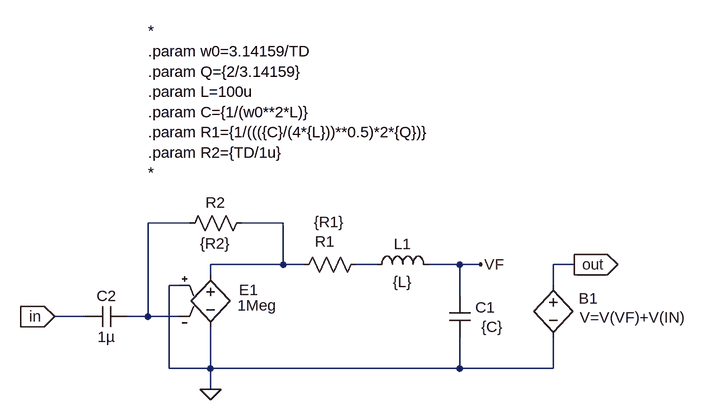
[diagram p0: schematic Zminus1ANA.asc]
Zminus1ANA.asc, the LTspice schematic file:
Version 4
SHEET 1 880 680
WIRE 64 64 0 64
WIRE 208 64 144 64
WIRE 208 128 208 64
WIRE 208 128 96 128
WIRE 240 128 208 128
WIRE 352 128 320 128
WIRE 480 128 432 128
WIRE 512 128 480 128
WIRE 656 128 624 128
WIRE 96 144 96 128
WIRE 48 160 32 160
WIRE 624 160 624 128
WIRE 480 176 480 128
WIRE -96 208 -144 208
WIRE 0 208 0 64
WIRE 0 208 -32 208
WIRE 48 208 0 208
WIRE 32 288 32 160
WIRE 96 288 96 224
WIRE 96 288 32 288
WIRE 480 288 480 240
WIRE 480 288 96 288
WIRE 624 288 624 240
WIRE 624 288 480 288
WIRE 96 320 96 288
FLAG 96 320 0
FLAG 512 128 VF
FLAG 656 128 out
IOPIN 656 128 Out
FLAG -144 208 in
IOPIN -144 208 In
DATAFLAG 640 128 ""
SYMBOL e 96 128 R0
WINDOW 0 44 39 Left 2
WINDOW 3 42 63 Left 2
SYMATTR InstName E1
SYMATTR Value 1Meg
SYMBOL res 336 112 R90
WINDOW 0 -4 64 VBottom 2
WINDOW 3 -65 57 VTop 2
SYMATTR InstName R1
SYMATTR Value {R1}
SYMBOL cap 496 240 R180
WINDOW 0 -39 46 Left 2
WINDOW 3 -51 16 Left 2
SYMATTR InstName C1
SYMATTR Value {C}
SYMBOL res 160 48 R90
WINDOW 0 0 56 VBottom 2
WINDOW 3 32 56 VTop 2
SYMATTR InstName R2
SYMATTR Value {R2}
SYMBOL ind 336 144 R270
WINDOW 0 32 56 VTop 2
WINDOW 3 5 56 VBottom 2
SYMATTR InstName L1
SYMATTR Value {L}
SYMBOL cap -32 192 R90
WINDOW 0 0 32 VBottom 2
WINDOW 3 32 32 VTop 2
SYMATTR InstName C2
SYMATTR Value 1µ
SYMBOL bv 624 144 R0
WINDOW 0 39 36 Left 2
WINDOW 3 41 65 Left 2
SYMATTR InstName B1
SYMATTR Value V=V(VF)+V(IN)
TEXT 0 -232 Left 2 !*\n.param w0=3.14159/TD\n.param Q={2/3.14159}\n.param L=100u\n.param C={1/(w0**2*L)}\n.param R1={1/((({C}/(4*{L}))**0.5)*2*{Q})}\n.param R2={TD/1u}\n*

The netlist it stands for:
* Zminus1ANA.asc
E1 N002 0 0 N001 1Meg
R1 N003 N002 {R1}
C1 0 VF {C}
R2 N002 N001 {R2}
L1 N003 VF {L}
C2 N001 in 1µ
B1 out 0 V=V(VF)+V(IN)
*
.param w0=3.14159/TD
.param Q={2/3.14159}
.param L=100u
.param C={1/(w0**2*L)}
.param R1={1/((({C}/(4*{L}))**0.5)*2*{Q})}
.param R2={TD/1u}
*
.backanno
.end